# EAGLE design AVR (EAGLE 9.6.0)
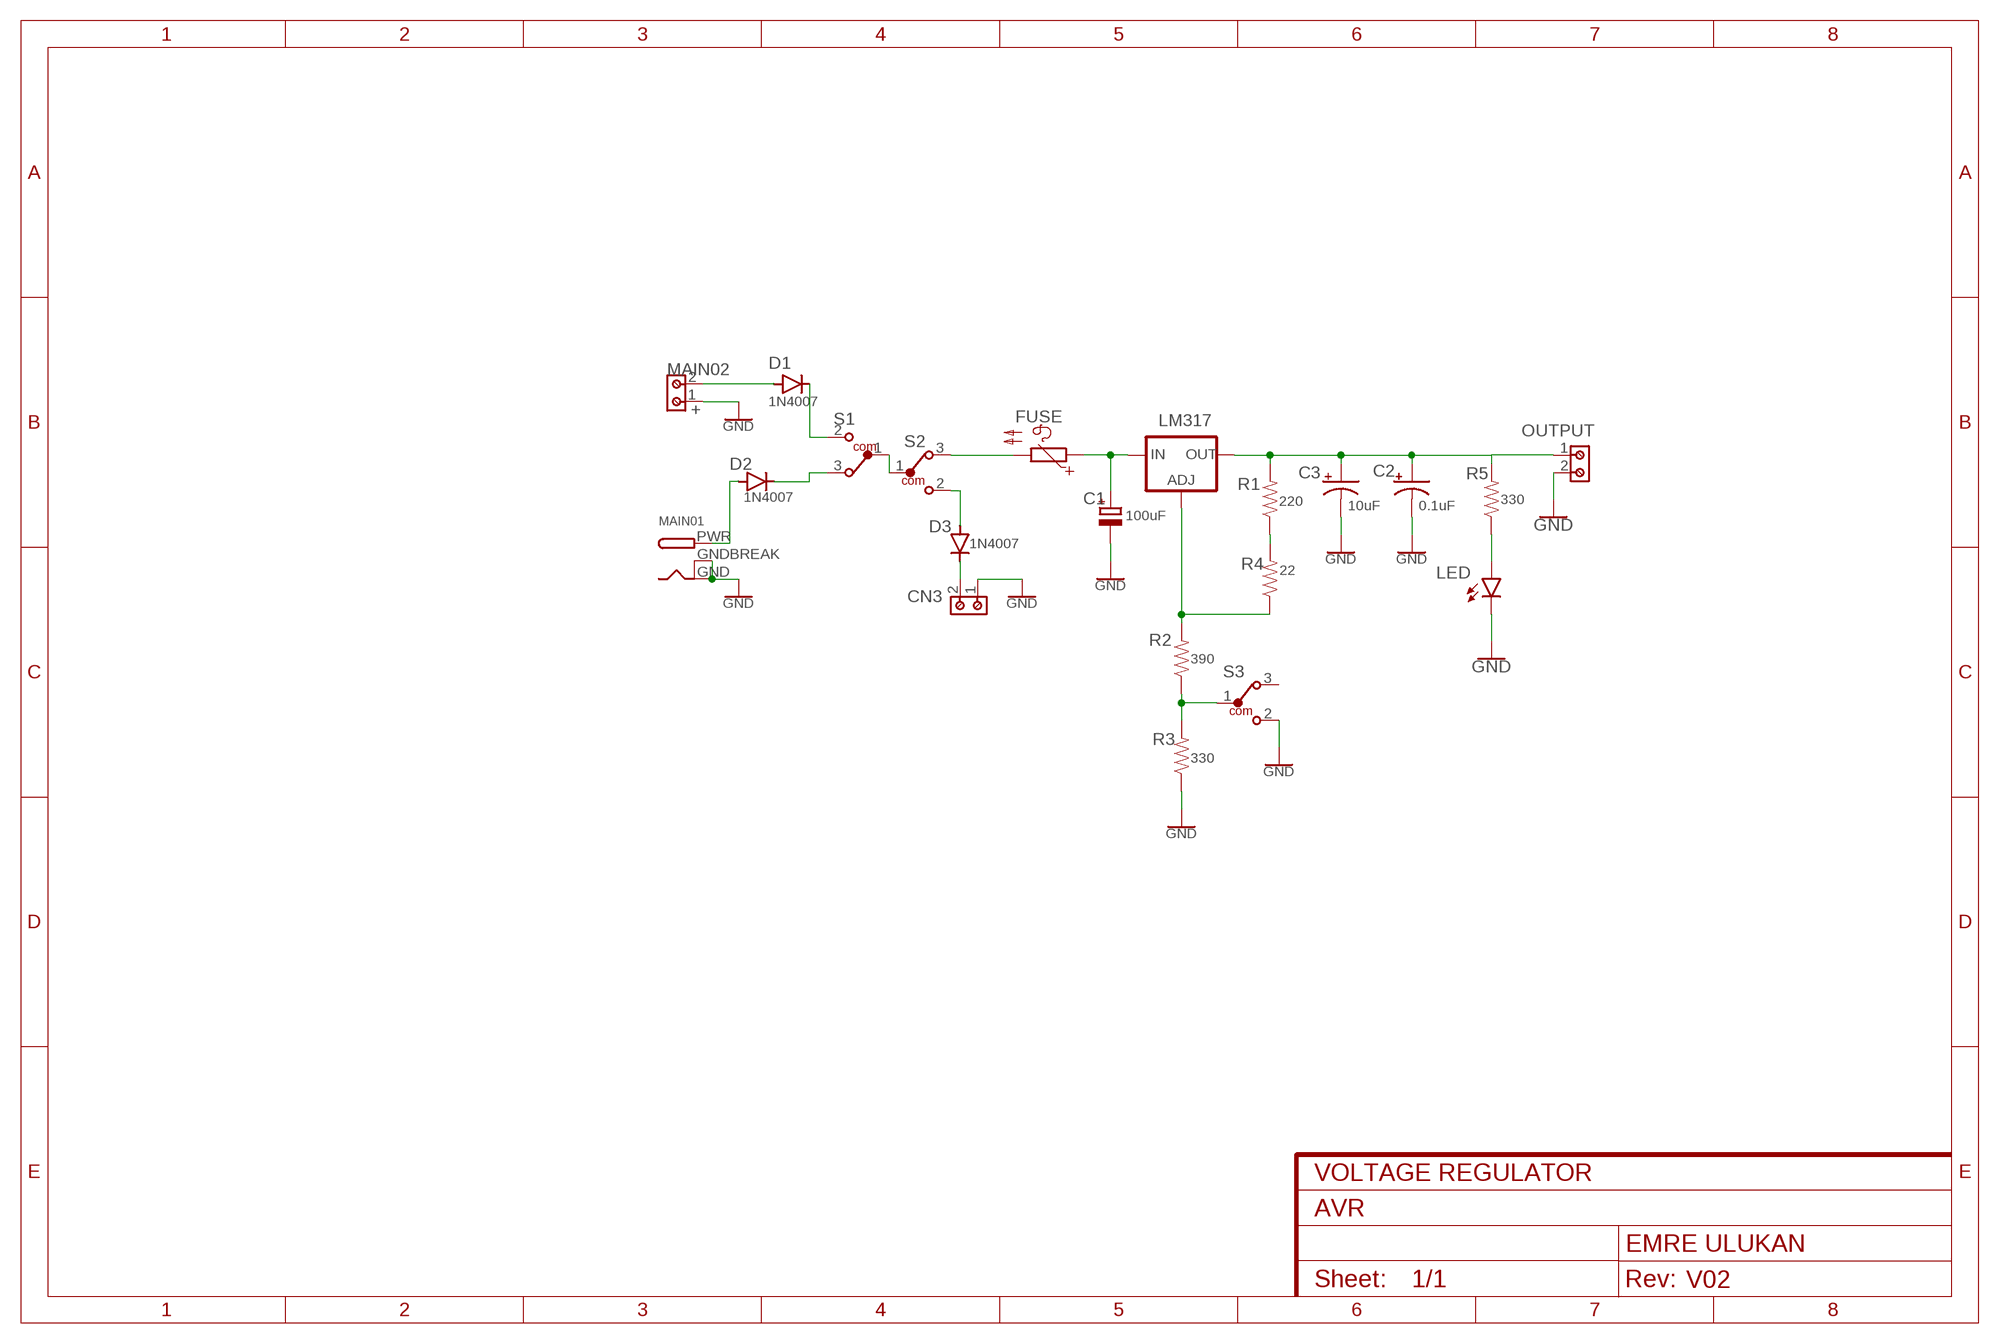
[diagram p0: schematic, sheet 1]
FRAME1 (FRAME-A4L): CNAME: VOLTAGE REGULATOR; CREVISION: V02; DESIGNER: EMRE ULUKAN

## Parts
C1  100uF  CPOL-EUE2-5  [E2-5]
C2  0.1uF  CAPACITOR-PE2.5-5  [E2,5-5]
C3  10uF  CAPACITOR-PE2.5-5  [E2,5-5]
CN3  691211720002  [691211720002]
D1  1N4007  1N4004  [DO-41]
D2  1N4007  1N4004  [DO-41]
D3  1N4007  1N4004  [DO-41]
FUSE  PTC660  [P660]
LED  LED3MM  [LED_3MM]
LM317  LM317  V_REG_317SINK  [TO220-ADJ]
MAIN01  DCBARRELPTH  [DCJACK_2MM_PTH]
MAIN02  691211720002  [691211720002]
OUTPUT  691211720002  [691211720002]
R1  220  1KOHM-HORIZ-1/4W-5%  [AXIAL-0.3]
R2  390  1KOHM-HORIZ-1/4W-5%  [AXIAL-0.3]
R3  330  1KOHM-HORIZ-1/4W-5%  [AXIAL-0.3]
R4  22  1KOHM-HORIZ-1/4W-5%  [AXIAL-0.3]
R5  330  1KOHM-HORIZ-1/4W-5%  [AXIAL-0.3]
S1  450301014042  [450301014042]
S2  450301014042  [450301014042]
S3  450301014042  [450301014042]

## Nets
GND: C1.- C2.- C3.- CN3.1 LED.K(C) MAIN01.GND MAIN01.GNDBREAK MAIN02.1 OUTPUT.2 R3.P$1 S3.2
N$1: D1.A MAIN02.2
N$2: D2.A MAIN01.PWR
N$3: D1.C S1.2
N$4: D2.C S1.3
N$5: S1.1 S2.1
N$6: FUSE.2 S2.3
N$7: CN3.2 D3.C
N$8: D3.A S2.2
N$9: C1.+ FUSE.1 LM317.IN
N$10: C2.+ C3.+ LM317.OUT OUTPUT.1 R1.P$2 R5.P$2
N$11: R1.P$1 R4.P$2
N$12: LM317.ADJ R2.P$2 R4.P$1
N$13: R2.P$1 R3.P$2 S3.1
N$14: LED.A R5.P$1
Unconnected: S3.3

## Notes on the sheet
- +

## Library data of the parts
C1 = rcl:CPOL-EU: POLARIZED CAPACITOR, European symbol; SPICEPREFIX: C
C2 C3 = BeagleBone_Blue_R3:CAPACITOR-P: POLARIZED CAPACITOR, American symbol
CN3 MAIN02 OUTPUT = Wurth_Connectors_WR-TBL Rising Cage Clamp:691211720002: WR-TBL Serie 211 - 5.00 mm 45° Entry Modular H=15.5mm KIND PROPERTIES Pitch 5 mm MATERIAL PROPERTIES Insulator Material PA66 Insulator Flammability Rating UL94 V-0 Insulator Color Green Contact Material Brass Contact Plating Copper over Zinc Terminal Screw Material Steel Terminal Screw Plating Zinc Wire Guard Material Brass GENERAL INFORMATION Operating Temperature -40 up to +105 °C Compliance Lead free / RoHS ELECTRICAL PROPERTIES IR UL 10 A Working Voltage [UL] 300 V (AC) Withstanding Voltage [UL] 1600 V (AC) Contact Resistance [UL] 20 mΩ MECHANICAL PROPERTIES Wire Strip Length 6 up to 7 (mm) Screw M2.5 CERTIFICATION cULus Approval E315414 UL Approval E315414 PACKAGING PROPERTIES Packaging Box <https://www.we-online.com/catalog/media/o33232v209%20Family_WR-TBL_69121172000x.jpg> Details see: https://www.we-online.com/catalog/en/TBL_5_00_211_45-DEGREE_ENTRY_MODULAR_69121172000X/ Updated by Ella Wu 2019-11-21 2019(C) Wurth Elektronik; DATASHEET-URL: https://www.we-online.com/catalog/datasheet/691211720002.pdf; IR-UL: 10A; MOUNT: THT; PART-NUMBER: 691211720002; PINS: 2; PITCH: 5mm; TYPE: 45°; WIRE: 24 to 12 (AWG) 0.205 to 3.31 (mm²); WORKING-VOLTAGE-UL: 300V (AC)
D1-D3 = Diodes:1N4004: DIODE GEN PURP 400V 1A DO41 Manufacturer's datasheet <https://www.mccsemi.com/pdf/Products/1N4001-1N4007(DO-41).pdf>; CREATED_BY: PCBLayout.com; DIGIKEY_PART_NUMBER: 1N4004MSCT-ND; MANUFACTURER: Micro Commercial Co; MPN: 1N4004; PACKAGE: DO-41
FUSE = ptc-ntc:PTC660: PHILIPS PTC; OC_FARNELL: unknown; OC_NEWARK: unknown
LED = SparkFun-LED:LED: LED (Generic) Standard schematic elements and footprints for 5mm, 3mm, 1206, and 0603 sized LEDs. Generic LEDs with no color specified.; PROD_ID: DIO-08794
LM317 = SparkFun-IC-Power:V_REG_317: Voltage Regulator Standard LM317 adjustable voltage regulator. AOI (Adjust Output Input). Google 'LM317 Calculator' for easy to use app to get the two resistor values needed. 240/720 for 5V output. 240/390 for 3.3V output. Spark Fun Electronics SKU : COM-00527
MAIN01 = adafruit:DCBARREL: 2.0mm DC Barrel Jack DCJACK_2MM_PTH - Through Hole Jack (4UConnector: 05537)
R1-R5 = SparkFun-Resistors:1KOHM: 1kΩ resistor A resistor is a passive two-terminal electrical component that implements electrical resistance as a circuit element. Resistors act to reduce current flow, and, at the same time, act to lower voltage levels within circuits. - Wikipedia; PROD_ID: RES-08380; VALUE: 1k
S1-S3 = Wurth_Switch_WS-SLTV:450301014042: WS-SLTV THT Mini Slide Switch, Opposite Side Connection 10x2.5 mm Properties Actuator Material:PA66 Actuator Flammability Rating:UL94 V-0 Actuator Color:Red Frame Material:PA66 Frame Flammability Rating:UL94 V-0 Frame Color:Grey Contact Material:Copper Alloy Contact Plating:Gold Terminal Material:Copper Alloy Terminal Plating:Gold Schematic:SPDT Switching Function:On-On Connection Type:Opposite Side Connection Operating Temperature:-40 up to +85 °C Qty.:200 Mechanical Properties Electrical Life:2000 Steps Switching Function:On-On Connection Type:Opposite Side Connection Packaging Properties Packaging :Bulk <https://www.we-online.com/catalog/media/o61141v209%20Family_WS-SLTV_THT_Mini_Slide_Switch_450301014042.jpg> Details see: https://www.we-online.com/catalog/en/SLTV_10X2_5_THT/ Updated by yingchun,Shan;2020-02-24 2020(C) Würth Elektronik; DATASHEET-URL: https://www.we-online.com/catalog/datasheet/450301014042.pdf; PACKAGING: Bulk; PART-NUMBER: 450301014042; QTY: 200

## Board
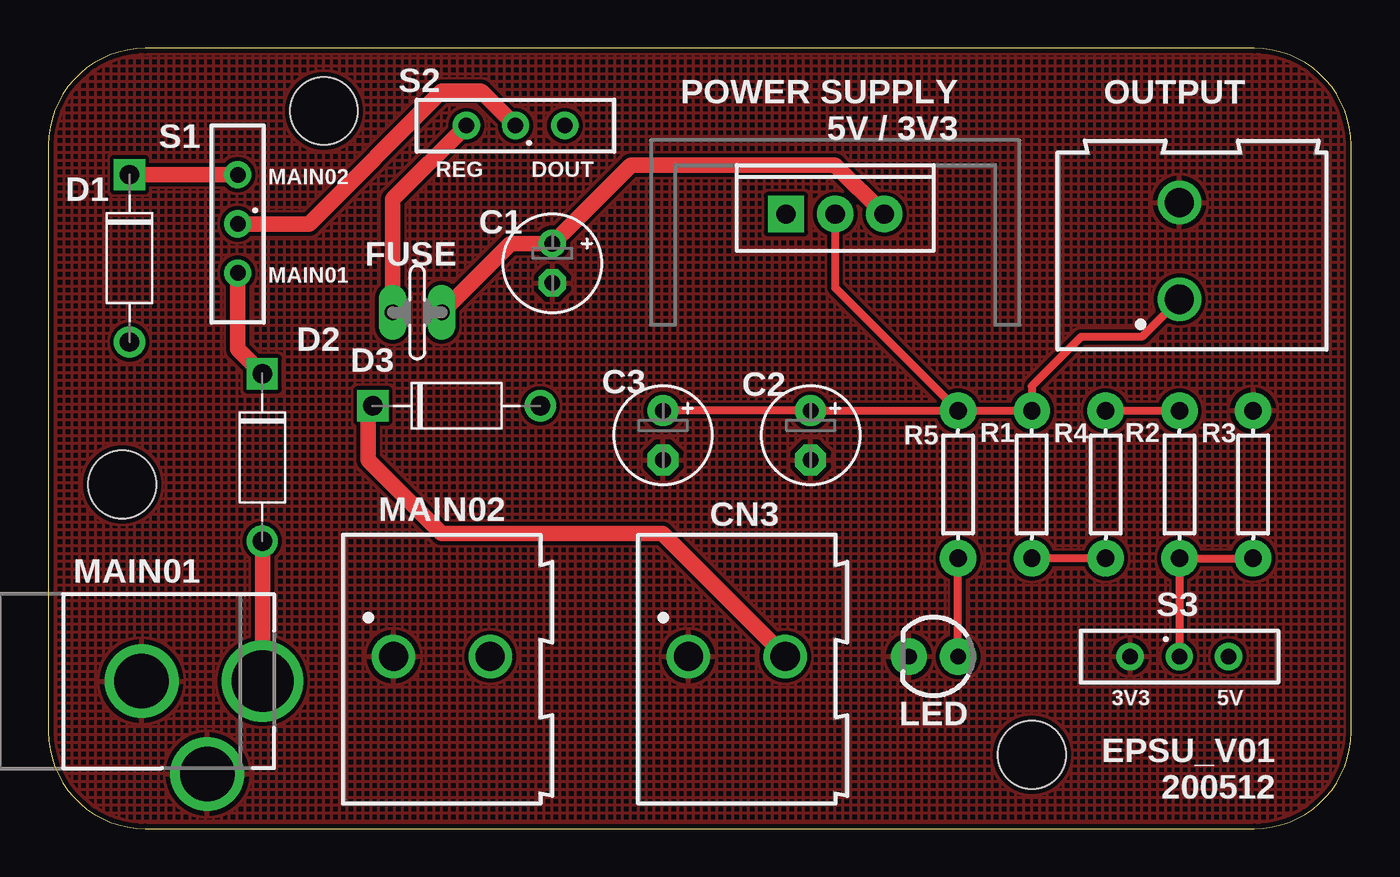
[diagram p1: board, top side]
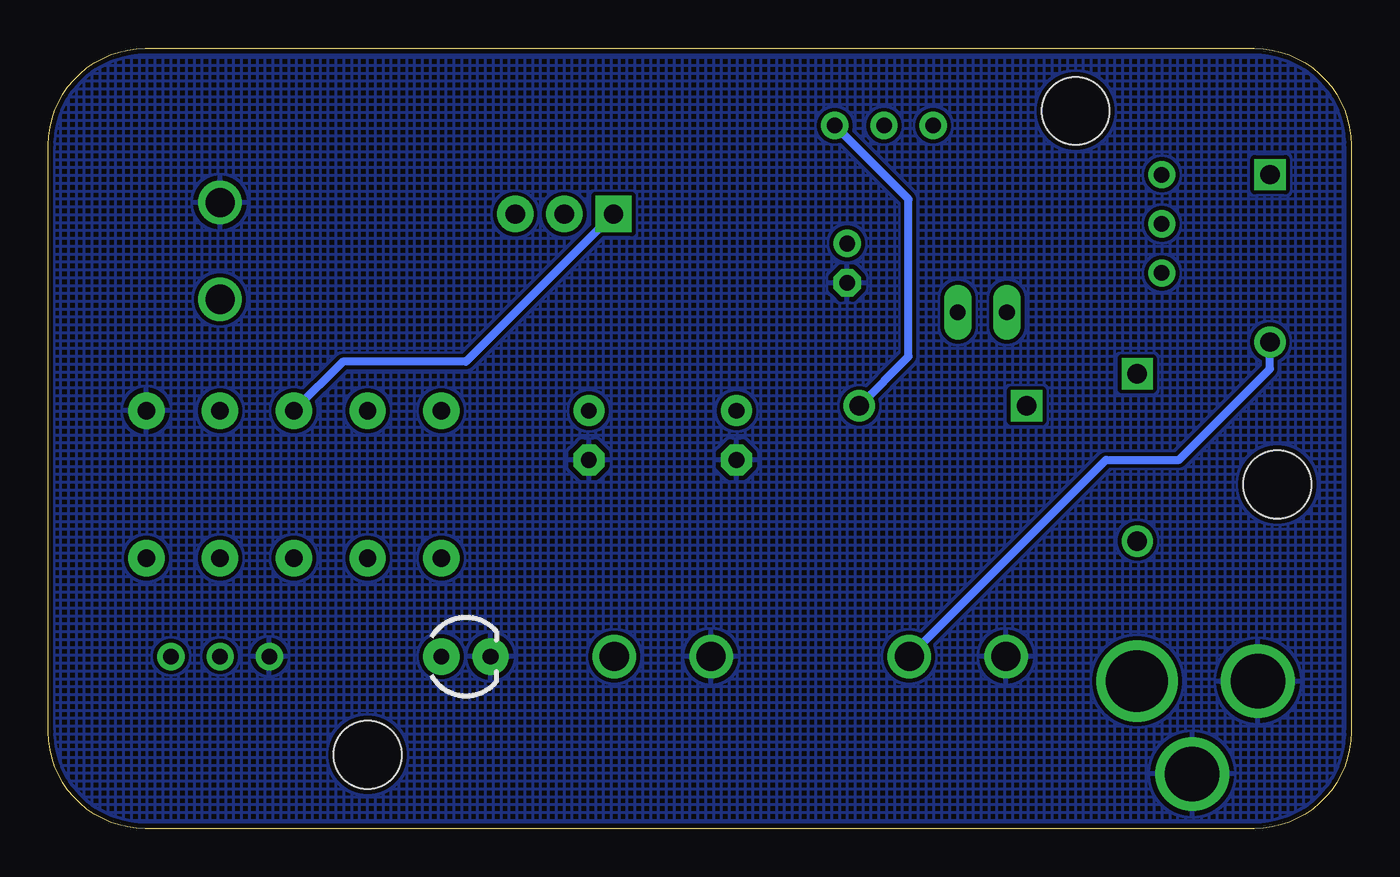
[diagram p2: board, bottom side, seen from below]

Size 67.29 x 40.31 mm. Coordinates in mm from the lower left corner, seen from the top.
Outline: 0,35.31 0,5 arc90 5,0 62.29,0 arc90 67.29,5 67.29,35.31 arc90 62.29,40.31 5,40.31 arc90 0,35.31
Copper layers (1*16): Top 0.035mm / dielectric 1.5mm / Bottom 0.035mm
Design rules "SparkFun": minimum track width 8mil, minimum drill 20mil, track to track 8mil, track to pad 8mil, pad to pad 8mil, via to via 8mil, smd to smd 8mil, copper to edge 10mil, drill to drill 8mil, minimum pad ring 12mil, minimum via ring 10mil, stop-mask expansion 4mil, vias tented up to drill 25mil, thermal gap 10mil
Holes 3.5 mm at 3.81,17.78 50.8,3.81 14.22,37.08

### Footprints (pad centres in the part's own frame; a part is rotated, then mirrored left to right if it is on the bottom)
E2-5 = drill 0.813 pad 1.27: + -1.016,0 | drill 0.813 pad 1.27 octagon: - 1.016,0
E2,5-5 = drill 0.813 pad 1.6: + -1.27,0 | drill 0.813 pad 1.6 octagon: - 1.27,0
691211720002 = drill 1.5: 1 -2.5,0; 2 2.5,0
DO-41 = drill 1: A 4.325,0 | drill 1 square: C -4.325,0
P660 = drill 0.813 long: 1 -1.27,0; 2 1.27,0
LED_3MM = drill 0.813 pad 1.88: A -1.27,0; K 1.27,0
TO220-ADJ = drill 1 pad 1.88 square: ADJ -2.54,0 | drill 1 pad 1.88: IN 2.54,0; OUT 0,0
DCJACK_2MM_PTH = drill 2.8: GND 0,7.35; GNDBREAK 4.8,10.75 | drill 3.2: PWR 0,13.6
AXIAL-0.3 = drill 0.9 pad 1.88: P$1 -3.81,0; P$2 3.81,0
450301014042 = drill 0.8: 1 0,0; 2 -2.54,0; 3 2.54,0

### Placement (x,y rotation side)
C1  26.04,29.21 270 top
C2  39.37,20.32 270 top
C3  31.75,20.32 270 top
CN3  35.56,8.89 0 top
D1  4.19,29.46 270 top
D2  11.05,19.18 270 top
D3  21.08,21.84 0 top
FUSE  19.05,26.67 180 top
LED  45.72,8.89 180 top
LM317  40.64,31.75 0 top
MAIN01  -2.54,7.62 270 top
MAIN02  20.32,8.89 0 top
OUTPUT  58.42,29.84 90 top
R1  50.8,17.78 90 top
R2  58.42,17.78 90 top
R3  62.23,17.78 270 top
R4  54.61,17.78 270 top
R5  46.99,17.78 90 top
S1  9.78,31.24 270 top
S2  24.13,36.32 180 top
S3  58.42,8.89 0 top

### Tracks (layer width: path | path; a pad name or v marks a point on that pad's centre or on a via)
GND
  pour Bottom (hatched): 0,0 67.31,0 67.31,40.64 0,40.64
  pour Top (hatched): 0,0 67.31,0 67.31,40.64 0,40.64
N$1
  Bottom 0.406: MAIN02.2 12.66,19.05 8.89,19.05 4.19,23.75 D1.A
N$2
  Top 0.813: MAIN01.PWR D2.A
N$3
  Top 0.813: D1.C S1.2
N$4
  Top 0.813: S1.3 9.78,24.77 D2.C
N$5
  Top 0.813: S1.1 13.46,31.24 20.32,38.1 22.35,38.1 S2.1
N$6
  Top 0.813: S2.3 17.78,32.51 FUSE.2
N$7
  Top 0.813: CN3.2 31.71,15.24 20.32,15.24 16.51,19.05 16.51,21.6 D3.C
N$8
  Bottom 0.406: D3.A 22.86,24.39 22.86,32.51 S2.2
N$9
  Top 0.813: FUSE.1 23.88,30.23 C1.+ 30.1,34.29 40.64,34.29 LM317.IN
N$10
  Top 0.406: R5.P$2 R1.P$2 50.8,22.86 53.34,25.4 56.48,25.4 OUTPUT.1 | C3.+ C2.+ R5.P$2 | LM317.OUT 40.64,27.94 R5.P$2
N$11
  Top 0.406: R4.P$2 R1.P$1
N$12
  Top 0.406: R4.P$1 R2.P$2
  Bottom 0.406: LM317.ADJ 45.72,24.13 52.07,24.13 R4.P$1
N$13
  Top 0.406: S3.1 R2.P$1 R3.P$2
N$14
  Top 0.406: LED.A R5.P$1

### Text on the board
tPlace: POWER SUPPLY / 5V / 3V3 | REG | DOUT | MAIN02 | MAIN01 | 3V3 | 5V | EPSU_V01 / 200512